# Altium project PCB_Project.PrjPcb
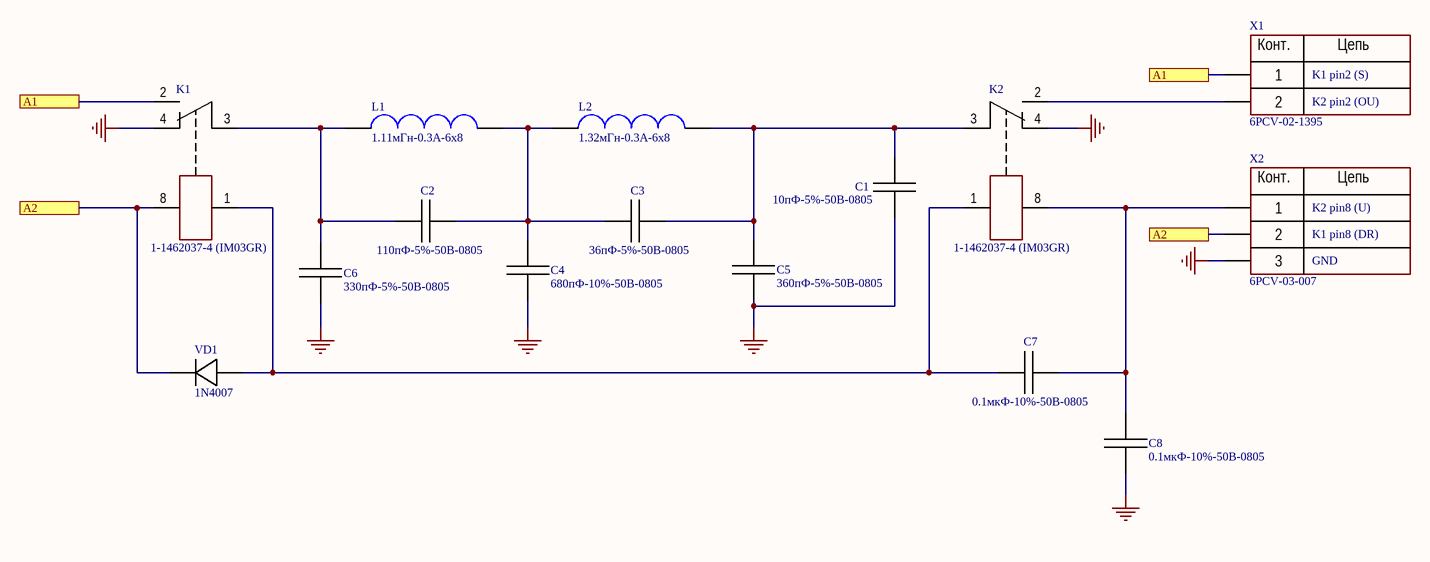
[diagram p0: SchematicDoc.SchDoc]
1 sheet, 15 parts. Net scope: flat (ports and power ports of the same name join across sheets).
Board file: Pcb.PcbDoc

## Sheet SchematicDoc.SchDoc: Плата фильтра 7/7,5мГц
size 420 x 297 mm; PageSetup: Record=PageOptions|CenterHorizontal=True|CenterVertical=True|PrintScale=1.00|XCorrection=1.00|YCorrection=1.00|PrintKind=1|BorderSize=5000000|LeftOffset=0|BottomOffset=0|Orientation=2|PaperLength=1000|PaperWidth=1000|Scale=100|PaperSource=15|PrintQuality=1200|MediaType=1|DitherType=10|PaperKind=A3|PrintScaleMode=1; Weight: -; ScaleFactor: -; Date: 05.05.2025; CheckedBy: Бойков; Author: Иванов; CompanyName: РРБО-01-24; Address1: Address1; Address2: Address2; Address3: Address3; Address4: Address4; DocumentNumber: МРАГ.43 1122.1000 Э3; SheetNumber: 1; SheetTotal: 1; DocumentType: Схема электрическая принципиальная; FirstReferrence: МРАГ.43 1122.100 Э3

### Parts
C1  10пФ-5%-50В-0805  [CAPAC_0805C]
C2  110пФ-5%-50В-0805  [CAPAC_0805C]
C3  36пФ-5%-50В-0805  [CAPAC_0805C]
C4  680пФ-10%-50В-0805  [CAPAC_0805C]
C5  360пФ-5%-50В-0805  [CAPAC_0805C]
C6  330пФ-5%-50В-0805  [CAPAC_0805C]
C7  0.1мкФ-10%-50В-0805  [CAPAC_0805C]
C8  0.1мкФ-10%-50В-0805  [CAPAC_0805C]
K1  1-1462037-4 (IM03GR)  [RELAY_IM03GR]
K2  1-1462037-4 (IM03GR)  [RELAY_IM03GR]
L1  1.11мГн-0.3А-6x8  [INDUCTOR_6x8]
L2  1.32мГн-0.3А-6x8  [INDUCTOR_6x8]
VD1  1N4007  [DIODE_DO-41]
X1  6PCV-02-1395  [CON_6PCV-02-006]
X2  6PCV-03-007  [CON_6PCV-03-006]

### Ports
A1, A2

### Nets
GND: C1.0 C4.0 C5.0 C6.0 C8.0 K1.4 K2.4 X2.3
NetC1_1: C1.1 C3.1 C5.1 K2.3(3(6)) L2.1
NetC2_0: C2.0 C3.0 C4.1 L1.1 L2.0
NetC2_1: C2.1 C6.1 K1.3(3(6)) L1.0
NetC7_0: C7.0 K1.1 K2.1 VD1.0
NetC7_1: C7.1 C8.1 K2.8 X2.1
NetK1_2: K1.2 X1.1 ; port A1
NetK1_8: K1.8 VD1.1 X2.2 ; port A2
NetK2_2: K2.2 X1.2

### Notes on the sheet
- K1 pin2 (S)
- K2 pin2 (OU)
- K2 pin8 (U)
- K1 pin8 (DR)
- GND
- Перв. примен.
- Справ. №
- Подп. и дата
- Инв. № дубл.
- Взам. инв. №
- Разраб.
- Изм.
- Лист
- № докум.
- Подп.
- Дата
- Лит.
- Масса
- Масштаб
- Пров.
- Т.контр.
- Листов
- Инв. № подл.
- Утв.
- Н.контр.
- 2.106-A3
- Копировал
- Формат А3
- (in symbol Con_2) Конт.; Цепь
- (in symbol Con_3) Конт.; Цепь

### Library data of the parts
C1 = Capac_0805C: Manufacturer: Murata Electronics; PartNumber: GRM2165C1H100JZ01D; Kind: Capacitor; Href: https://www.chipdip.ru/product/grm2165c1h100j; Value: 10пФ-5%-50В-0805
C2 = Capac_0805C: Manufacturer: Тайвань; PartNumber: MLCC110pFNPO50V5%0805; Kind: Capacitor; Href: https://www.chipdip.ru/product0/636411021; Value: 110пФ-5%-50В-0805
C3 = Capac_0805C: Manufacturer: Тайвань; PartNumber: MLCC36pFNPO50V5%0805; Kind: Capacitor; Href: https://www.chipdip.ru/product0/949006145; Value: 36пФ-5%-50В-0805
C4 = Capac_0805C: Manufacturer: Murata Electronics; PartNumber: GRM216R71H681KA01D; Kind: Capacitor; Href: https://www.chipdip.ru/product/grm216r71h681k; Value: 680пФ-10%-50В-0805
C5 = Capac_0805C: Manufacturer: Murata Electronics; PartNumber: GRM2165C1H360JZ01D; Kind: Capacitor; Href: https://www.chipdip.ru/product/grm2165c1h360j; Value: 360пФ-5%-50В-0805
C6 = Capac_0805C: Manufacturer: Murata Electronics; PartNumber: GRM2165C1H331JA01D; Kind: Capacitor; Href: https://www.chipdip.ru/product/grm2165c1h331j; Value: 330пФ-5%-50В-0805
C7 C8 = Capac_0805C: Manufacturer: Murata Electronics; PartNumber: GRM21BR71H104KA01L; Kind: Capacitor; Href: https://www.chipdip.ru/product/grm21br71h104k; Value: 0.1мкФ-10%-50В-0805
K1 K2 = Realy_IM03GR: Manufacturer: TE Connectivity; Kind: Relay; Href: https://www.chipdip.ru/product/1-1462037-4-im03gr; PartNumber: 1-1462037-4 (IM03GR)
L1 L2 = Induc_0805I: Manufacturer: QBYDIY; Kind: Inductor; PartNumber: *; Href: https://aliexpress.ru/item/1005004542825940.html?spm=a2g2w.productlist.rcmdprod.0.e96d59dfPlHqNd&sku_id=12000029543884035
  L1: Value: 1.11мГн-0.3А-6x8
  L2: Value: 1.32мГн-0.3А-6x8
VD1 = Diode: Manufacturer: Diotec Semiconductor; PartNumber: 1N4007; Kind: Diode; Href: https://www.chipdip.ru/product/1n4007
X1 = Con_2: Manufacturer: TE Connectivity; Kind: Connector; PartNumber: 6PCV-02-1395; Href: https://www.chipdip.ru/product0/8004913421
X2 = Con_3: Manufacturer: TE Connectivity; Kind: Connector; PartNumber: 6PCV-03-007; Href: https://www.chipdip.ru/product0/8005967819